# Altium schematic sheet S7CAS-PLEIADES-CARTE-MERE_P02_FLASH.SchDoc
size Tabloid; DocumentNumber: 13; SheetNumber: 13; SheetTotal: 14; Size: 11x17; Sheet_Name: Flash
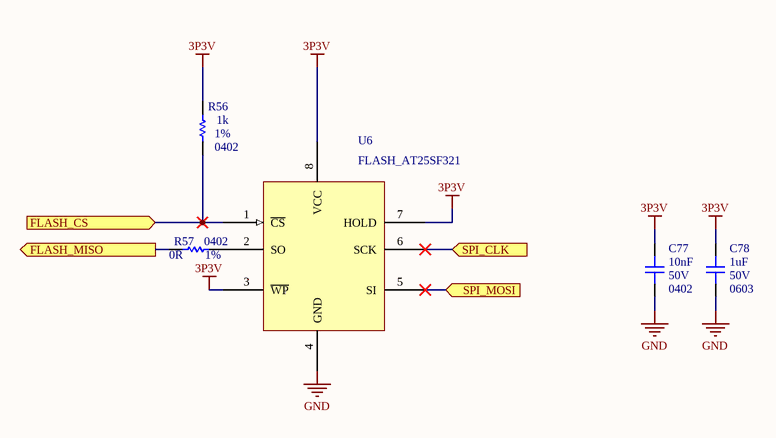
[diagram p0: S7CAS-PLEIADES-CARTE-MERE_P02_FLASH.SchDoc]

## Parts
C77  value 10nF  Voltage: 50V  Package: 0402  [CAP_0402]  (hidden comment: CAP - 0603)
C78  value 1uF  Voltage: 50V  Package: 0603  [CAP_0603]  (hidden comment: CAP - 0603)
R56  value 1k  Package: 0402  Precision: 1%  [RES_0402]  (hidden comment: RES - 0402)
R57  value 0R  Package: 0402  Precision: 1%  [RES_0402]  (hidden comment: RES - 0402)
U6  FLASH_AT25SF321  [8-SOIC]

## Ports
FLASH_CS (in), FLASH_MISO (out), SPI_CLK (in), SPI_MOSI (in)

## Nets
3P3V: C77.2 C78.2 R56.2 U6.3(~{WP}) U6.7(HOLD) U6.8(VCC)
GND: C77.1 C78.1 U6.4(GND)
FLASH_CS: R56.1 U6.1(~{CS}) ; port FLASH_CS
FLASH_MISO: R57.2 ; port FLASH_MISO
SPI_CLK: U6.6(SCK) ; port SPI_CLK
SPI_MOSI: U6.5(SI) ; port SPI_MOSI
NetR57_1: R57.1 U6.2(SO)

## Notes on the sheet
- Sheet Name
- Project Title
- Global Project
- Size
- Group
- Revision
- Date
- Sheet
- of
- Filename
- Designers

## Library data of the parts
C77 C78 = CAP - 0603: Precision: 10%; Current: *; CreatedBy: Jonathan Bouchard; Power: *
R56 R57 = RES - 0402: Voltage: 50V; Power: 1/16W; Current: *; CreatedBy: Jonathan Bouchard